# Altium schematic sheet RelayDriver.SchDoc: PCB-Tester Relay Driver
size A4 portrait; Date: JUN 2020; CheckedBy: Moerz, Hoeren; Author: Rudziński; CompanyName: TDK-Micronas GmbH; DrawnBy: Rudziński; Engineer: Rudziński; Organization: Test Engineering; Address1: Hans-Bunte-Strasse 19; Address2: D-79108 Freiburg; Address3: Germany; DocumentNumber: U33110; Revision: V1.0; SheetNumber: 8; SheetTotal: 20; DateDraw: JUN 2020; DateChecked: 2020-06-19; Workspace: Workspace; TitleTyp: Title-Typ; PageSetup: Record=PageOptions|CenterHorizontal=True|CenterVertical=True|PrintScale=0.97|XCorrection=1.00|YCorrection=1.00|PrintKind=0|BorderSize=5000000|LeftOffset=0|BottomOffset=0|Orientation=2|PaperLength=1000|PaperWidth=1000|Scale=100|PaperSource=7|PrintQuality=-3|MediaType=1|DitherType=10|PrintScaleMode=1|PaperKind=A4|PaperIndex=9
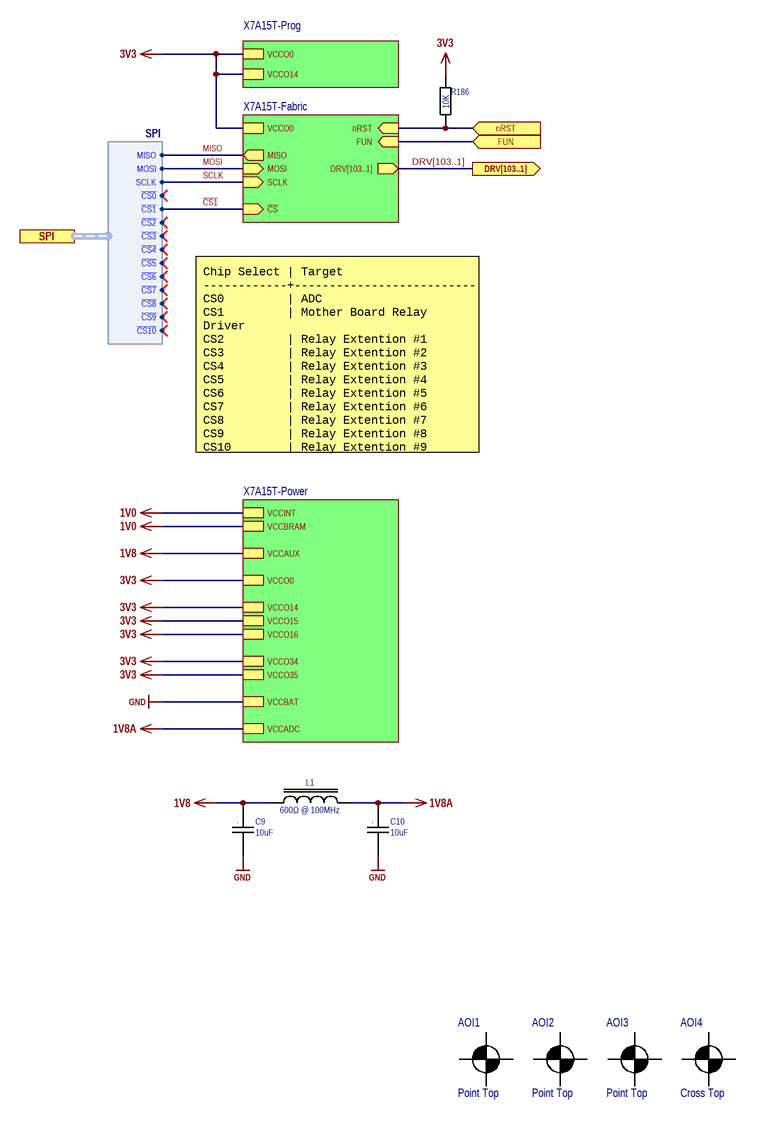
[diagram p0: RelayDriver.SchDoc]

## Parts
AOI1  Shape: Point Top  [Fiducial Point]  (hidden comment: AOI)  (no BOM)
AOI2  Shape: Point Top  [Fiducial Point]  (hidden comment: AOI)  (no BOM)
AOI3  Shape: Point Top  [Fiducial Point]  (hidden comment: AOI)  (no BOM)
AOI4  Shape: Cross Top  [Fiducial Cross]  (hidden comment: AOI)  (no BOM)
C9  value 10uF  [C0805 Reflow]  (hidden comment: C)
C10  value 10uF  [C0805 Reflow]  (hidden comment: C)
L1  Nominal Impedance: 600Ω @ 100MHz  [FB0805]  (hidden comment: L)
R186  value 10K  [R0402 Reflow]  (hidden comment: R)

## Sub-sheets
X7A15T-Fabric = X7A15T-Fabric.SchDoc: SCLK (in), MISO (out), VCCO0, MOSI (in), ~{CS} (in), DRV[103..1] (out), nRST (in), FUN (in)
X7A15T-Power = X7A15T-Power.SchDoc: VCCADC, VCCO0, VCCO14, VCCO35, VCCO16, VCCAUX, VCCINT, VCCO34, VCCBRAM, VCCO15, VCCBAT
X7A15T-Prog = X7A15T-Prog.SchDoc: VCCO0, VCCO14

## Ports
DRV[103..1] (out), FUN (in), nRST (in), SPI (harness SPI)

## Harnesses
SPI: MISO, MOSI, SCLK, ~{CS0}, ~{CS1}, ~{CS2}, ~{CS3}, ~{CS4}, ~{CS5}, ~{CS6}, ~{CS7}, ~{CS8}, ~{CS9}, ~{CS10}

## Nets
1V0: sheet X7A15T-Power/VCCINT, sheet X7A15T-Power/VCCBRAM
1V8: C9.1 L1.1 ; sheet X7A15T-Power/VCCAUX
1V8A: C10.1 L1.2 ; sheet X7A15T-Power/VCCADC
3V3: R186.1 ; sheet X7A15T-Prog/VCCO0, sheet X7A15T-Prog/VCCO14, sheet X7A15T-Fabric/VCCO0, sheet X7A15T-Power/VCCO0, sheet X7A15T-Power/VCCO14, sheet X7A15T-Power/VCCO35, sheet X7A15T-Power/VCCO16, sheet X7A15T-Power/VCCO34, sheet X7A15T-Power/VCCO15
GND: C9.2 C10.2 ; sheet X7A15T-Power/VCCBAT
~{CS1}: sheet X7A15T-Fabric/~{CS}, port SPI.~{CS1}
FUN: port FUN, sheet X7A15T-Fabric/FUN
MISO: sheet X7A15T-Fabric/MISO, port SPI.MISO
MOSI: sheet X7A15T-Fabric/MOSI, port SPI.MOSI
nRST: R186.2 ; port nRST, sheet X7A15T-Fabric/nRST
SCLK: sheet X7A15T-Fabric/SCLK, port SPI.SCLK

## Buses and harness runs
bus DRV[103..1] = port DRV[103..1] = sheet X7A15T-Fabric/DRV[103..1]

## Notes on the sheet
- Chip Select | Target
  ------------+--------------------------
  CS0         | ADC
  CS1         | Mother Board Relay Driver
  CS2         | Relay Extention #1
  CS3         | Relay Extention #2
  CS4         | Relay Extention #3
  CS5         | Relay Extention #4
  CS6         | Relay Extention #5
  CS7         | Relay Extention #6
  CS8         | Relay Extention #7
  CS9         | Relay Extention #8
  CS10        | Relay Extention #9
- designed by
- reviewed by
- last drawn by
- Project:
- Schematic:
- last printed
- DIN-A4 P
- sheets
- of
- File:
- (in symbol C) .

## Library data of the parts
AOI1-AOI4 = Fiducial: Assembly AOI; 13. Created Date/Name: AUG2018/Hören; 01. Distributor: N/A; 02. Distributor Part Number: N/A; 03. Unit Price: N/A; 04. Manufacturer: N/A; 05. Quantity: N/A; 06. Data Sheet: N/A; 07. Manufacturer  Part Number: N/A; 08. Inhouse Stock: N/A; 09. Operating Temperature: N/A; 10. Weight: N/A; 11. RoHS: N/A; 12.UL94 Flammability: N/A; ComponentLink1Description: Info; ComponentLink2Description: Info
C9 C10 = C: CAP CER 10UF 10V X7R 0805; 04. Manufacturer: Samsung Electro-Mechanics; 07. Manufacturer  Part Number: CL21B106KPQNNNE; Tolerance: ±10%; 03. Unit Price: 0.24; 13. Created Date/Name: AUG2018/Hören; Voltage Rating: 10V; Type: X7R; ComponentLink1Description: Info; ComponentLink1URL: https://www.digikey.de/products/en?keywords=1276-1764-6-ND; 02. Distributor Part Number: 1276-1764-6-ND; 09. Operating Temperature: -55°C ~ 125°C; 11. RoHS: YES; 01. Distributor: DigiKey; ComponentLink2Description: DataSheet; Package: 0805
L1 = FB: FERRITE BEAD 600 OHM 0805 1LN; 04. Manufacturer: Würth Elektronik; 07. Manufacturer  Part Number: 742792040; DCR: 150mΩ; Impedance Tolerance: %; 03. Unit Price: 0.22; 13. Created Date/Name: AUG2018/Hören; IRMS: 2A; ComponentLink1Description: Info; ComponentLink1URL: https://www.digikey.de/products/en?keywords=732-1620-6-ND; ComponentLink2Description: DataSheet; ComponentLink2URL: https://www.we-online.de/katalog/datasheet/742792040.pdf; 02. Distributor Part Number: 732-1620-6-ND; 09. Operating Temperature: -55°C ~ 125°C; 11. RoHS: YES; 01. Distributor: DigiKey; ISAT: *; Package: 0805; Tolerance: *; Value: *
R186 = R: RES SMD 10K OHM 1% 1/16W 0402; 04. Manufacturer: Yageo; 07. Manufacturer  Part Number: RC0402FR-0710KL; 03. Unit Price: 0.09; 13. Created Date/Name: AUG2018/Hören; Power Rating: 63mW; Tolerance: ±1%; ComponentLink1URL: https://www.digikey.de/products/en?keywords=311-10.0KLRDKR-ND; ComponentLink1Description: Info; 02. Distributor Part Number: 311-10.0KLRDKR-ND; 09. Operating Temperature: -55°C ~ 155°C; 11. RoHS: YES; 01. Distributor: DigiKey; ComponentLink2Description: DataSheet; Type: Thick Film; Package: 0402